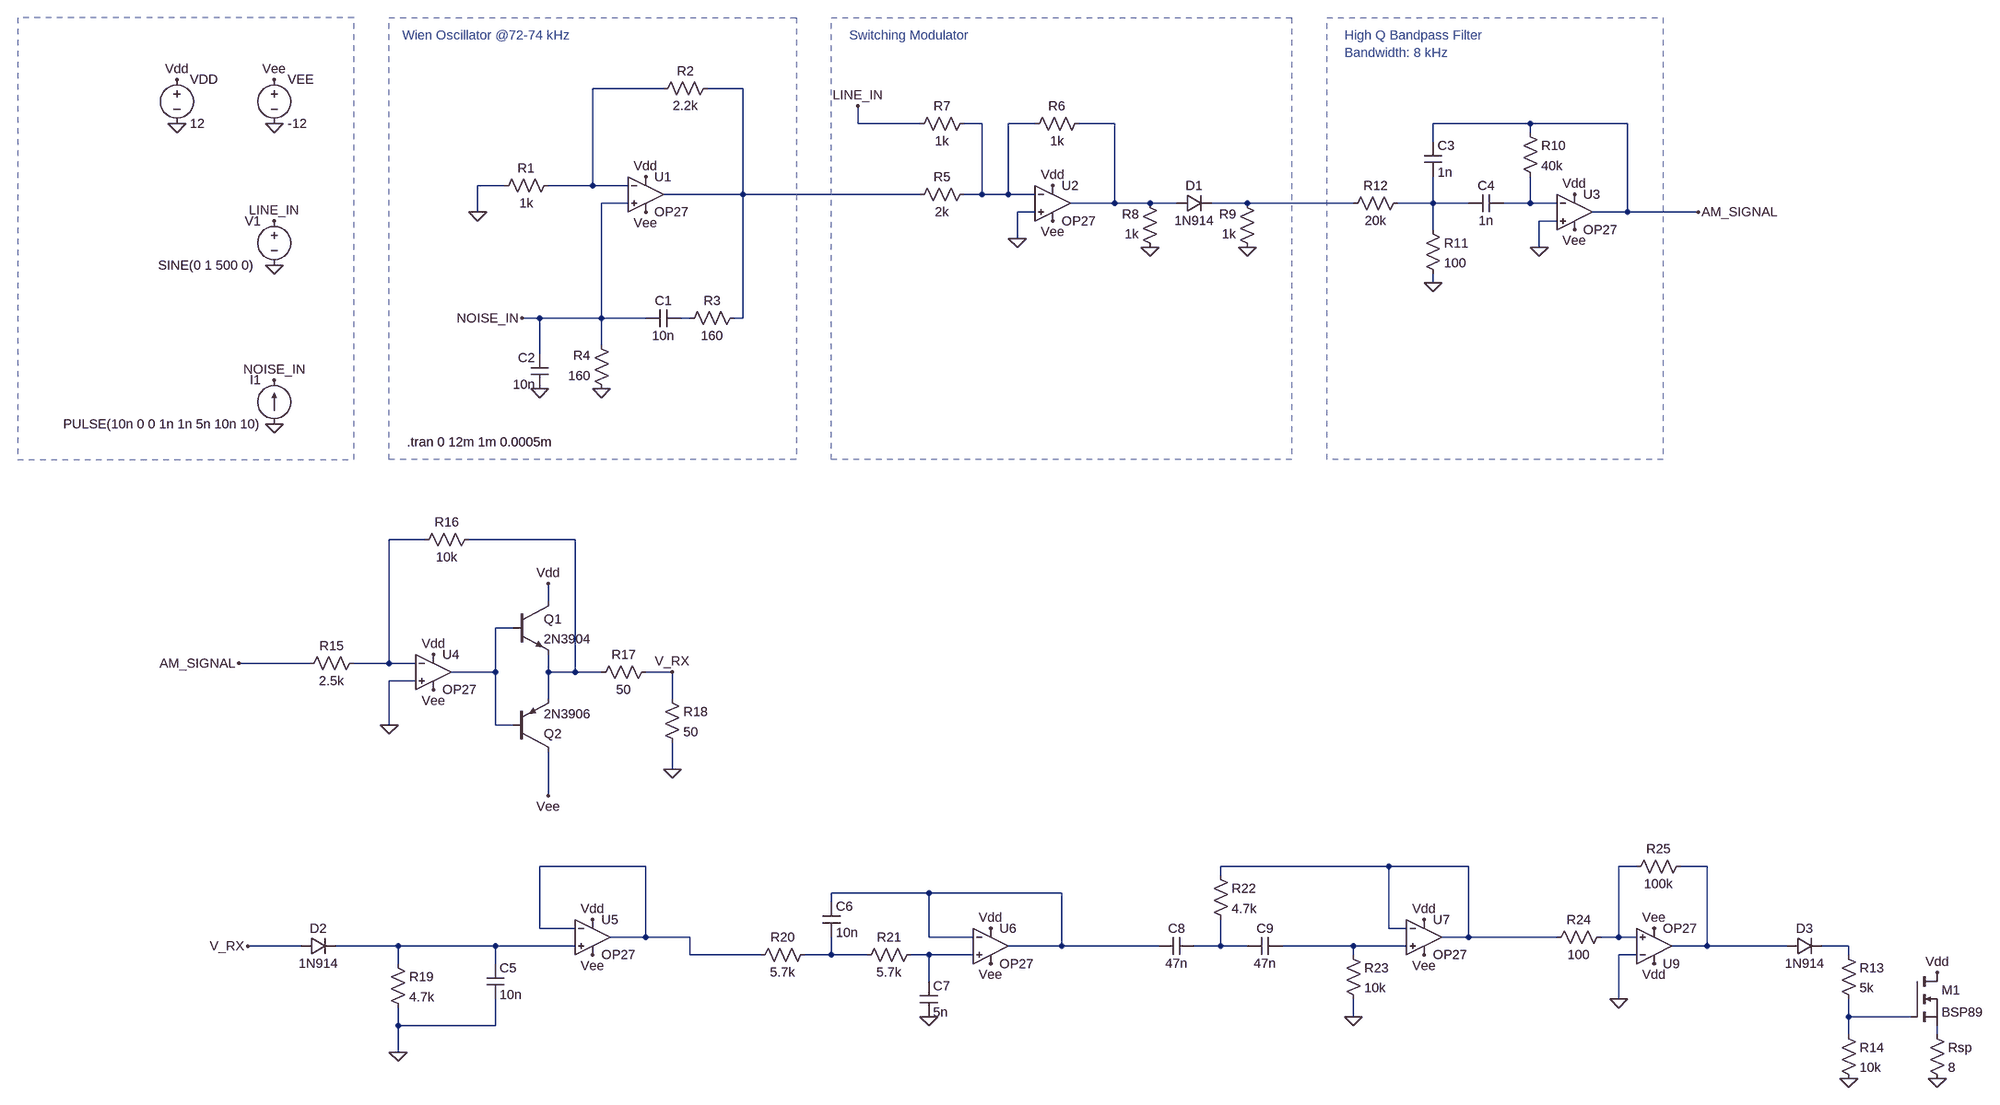
[diagram p0: schematic Draft1.asc]
Draft1.asc, the LTspice schematic file:
Version 4
SHEET 1 3092 1716
WIRE 624 -128 496 -128
WIRE 768 -128 704 -128
WIRE 976 -64 976 -96
WIRE 1088 -64 976 -64
WIRE 1200 -64 1168 -64
WIRE 1296 -64 1248 -64
WIRE 1440 -64 1376 -64
WIRE 2192 -64 2016 -64
WIRE 2368 -64 2192 -64
WIRE 2192 -48 2192 -64
WIRE 2016 -32 2016 -64
WIRE 336 48 288 48
WIRE 496 48 496 -128
WIRE 496 48 416 48
WIRE 560 48 496 48
WIRE 768 64 768 -128
WIRE 768 64 624 64
WIRE 1088 64 768 64
WIRE 1200 64 1200 -64
WIRE 1200 64 1168 64
WIRE 1248 64 1248 -64
WIRE 1248 64 1200 64
WIRE 1296 64 1248 64
WIRE 560 80 512 80
WIRE 1440 80 1440 -64
WIRE 1440 80 1360 80
WIRE 1504 80 1440 80
WIRE 1552 80 1504 80
WIRE 1680 80 1616 80
WIRE 1872 80 1680 80
WIRE 2016 80 2016 32
WIRE 2016 80 1952 80
WIRE 2080 80 2016 80
WIRE 2192 80 2192 32
WIRE 2192 80 2144 80
WIRE 2240 80 2192 80
WIRE 288 96 288 48
WIRE 1296 96 1264 96
WIRE 2368 96 2368 -64
WIRE 2368 96 2304 96
WIRE 2496 96 2368 96
WIRE 2240 112 2208 112
WIRE 2016 128 2016 80
WIRE 1264 144 1264 96
WIRE 2208 160 2208 112
WIRE 2016 224 2016 208
WIRE 400 288 368 288
WIRE 512 288 512 80
WIRE 512 288 400 288
WIRE 592 288 512 288
WIRE 672 288 656 288
WIRE 768 288 768 64
WIRE 768 288 752 288
WIRE 512 336 512 288
WIRE 400 352 400 288
WIRE 192 704 128 704
WIRE 464 704 272 704
WIRE 416 816 416 784
WIRE 352 864 320 864
WIRE -16 928 -144 928
WIRE 128 928 128 704
WIRE 128 928 64 928
WIRE 176 928 128 928
WIRE 320 944 320 864
WIRE 320 944 240 944
WIRE 416 944 416 912
WIRE 464 944 464 704
WIRE 464 944 416 944
WIRE 512 944 464 944
WIRE 640 944 592 944
WIRE 176 960 128 960
WIRE 416 992 416 944
WIRE 640 992 640 944
WIRE 128 1040 128 960
WIRE 320 1040 320 944
WIRE 352 1040 320 1040
WIRE 640 1120 640 1072
WIRE 416 1168 416 1088
WIRE 592 1296 400 1296
WIRE 1936 1296 1632 1296
WIRE 2080 1296 1936 1296
WIRE 2384 1296 2352 1296
WIRE 2512 1296 2464 1296
WIRE 1632 1312 1632 1296
WIRE 1104 1344 928 1344
WIRE 1344 1344 1104 1344
WIRE 928 1360 928 1344
WIRE 400 1408 400 1296
WIRE 464 1408 400 1408
WIRE 1936 1408 1936 1296
WIRE 1968 1408 1936 1408
WIRE 592 1424 592 1296
WIRE 592 1424 528 1424
WIRE 672 1424 592 1424
WIRE 1104 1424 1104 1344
WIRE 1184 1424 1104 1424
WIRE 2080 1424 2080 1296
WIRE 2080 1424 2032 1424
WIRE 2240 1424 2080 1424
WIRE 2352 1424 2352 1296
WIRE 2352 1424 2320 1424
WIRE 2384 1424 2352 1424
WIRE -32 1440 -128 1440
WIRE 144 1440 32 1440
WIRE 320 1440 144 1440
WIRE 464 1440 320 1440
WIRE 1344 1440 1344 1344
WIRE 1344 1440 1248 1440
WIRE 1520 1440 1344 1440
WIRE 1632 1440 1632 1392
WIRE 1632 1440 1584 1440
WIRE 1680 1440 1632 1440
WIRE 1872 1440 1744 1440
WIRE 1968 1440 1872 1440
WIRE 2512 1440 2512 1296
WIRE 2512 1440 2448 1440
WIRE 2656 1440 2512 1440
WIRE 2768 1440 2720 1440
WIRE 672 1456 672 1424
WIRE 800 1456 672 1456
WIRE 928 1456 928 1424
WIRE 928 1456 880 1456
WIRE 992 1456 928 1456
WIRE 1104 1456 1072 1456
WIRE 1184 1456 1104 1456
WIRE 1872 1456 1872 1440
WIRE 2384 1456 2352 1456
WIRE 2768 1456 2768 1440
WIRE 144 1472 144 1440
WIRE 320 1472 320 1440
WIRE 1104 1504 1104 1456
WIRE 2352 1536 2352 1456
WIRE 1872 1568 1872 1536
WIRE 2768 1568 2768 1536
WIRE 2880 1568 2768 1568
WIRE 144 1584 144 1552
WIRE 320 1584 320 1536
WIRE 320 1584 144 1584
WIRE 2768 1600 2768 1568
WIRE 2928 1600 2928 1584
WIRE 144 1632 144 1584
FLAG -256 -64 0
FLAG -80 -64 0
FLAG -256 -144 Vdd
FLAG -80 -144 Vee
FLAG 288 96 0
FLAG 512 416 0
FLAG 400 416 0
FLAG -80 480 0
FLAG 592 32 Vdd
FLAG 592 96 Vee
FLAG -80 192 0
FLAG 1504 160 0
FLAG 1680 160 0
FLAG -80 112 LINE_IN
FLAG -80 400 NOISE_IN
FLAG 368 288 NOISE_IN
FLAG 976 -96 LINE_IN
FLAG 1264 144 0
FLAG 1328 48 Vdd
FLAG 1328 112 Vee
FLAG 2208 160 0
FLAG 2272 64 Vdd
FLAG 2272 128 Vee
FLAG 2016 224 0
FLAG 2496 96 AM_SIGNAL
FLAG -144 928 AM_SIGNAL
FLAG 208 912 Vdd
FLAG 416 784 Vdd
FLAG 208 976 Vee
FLAG 416 1168 Vee
FLAG 128 1040 0
FLAG 640 1120 0
FLAG 640 944 V_RX
FLAG -128 1440 V_RX
FLAG 144 1632 0
FLAG 496 1392 Vdd
FLAG 496 1456 Vee
FLAG 1216 1408 Vdd
FLAG 1216 1472 Vee
FLAG 1104 1568 0
FLAG 2000 1392 Vdd
FLAG 2000 1456 Vee
FLAG 1872 1568 0
FLAG 2416 1472 Vdd
FLAG 2416 1408 Vee
FLAG 2352 1536 0
FLAG 2768 1680 0
FLAG 2928 1680 0
FLAG 2928 1488 Vdd
SYMBOL voltage -256 -160 R0
SYMATTR InstName VDD
SYMATTR Value 12
SYMBOL voltage -80 -160 R0
SYMATTR InstName VEE
SYMATTR Value -12
SYMBOL res 432 32 R90
WINDOW 0 0 56 VBottom 2
WINDOW 3 32 56 VTop 2
SYMATTR InstName R1
SYMATTR Value 1k
SYMBOL Opamps\\OP27 592 0 R0
SYMATTR InstName U1
SYMBOL res 720 -144 R90
WINDOW 0 0 56 VBottom 2
WINDOW 3 32 56 VTop 2
SYMATTR InstName R2
SYMATTR Value 2.2k
SYMBOL res 656 304 R270
WINDOW 0 32 56 VTop 2
WINDOW 3 0 56 VBottom 2
SYMATTR InstName R3
SYMATTR Value 160
SYMBOL res 528 432 R180
WINDOW 0 36 76 Left 2
WINDOW 3 36 40 Left 2
SYMATTR InstName R4
SYMATTR Value 160
SYMBOL cap 656 272 R90
WINDOW 0 0 32 VBottom 2
WINDOW 3 32 32 VTop 2
SYMATTR InstName C1
SYMATTR Value 10n
SYMBOL cap 416 416 R180
WINDOW 0 24 56 Left 2
WINDOW 3 24 8 Left 2
SYMATTR InstName C2
SYMATTR Value 10n
SYMBOL current -80 480 R180
WINDOW 0 24 80 Left 2
WINDOW 3 24 0 Left 2
WINDOW 123 0 0 Left 0
WINDOW 39 0 0 Left 0
SYMATTR InstName I1
SYMATTR Value PULSE(10n 0 0 1n 1n 5n 10n 10)
SYMBOL res 1184 48 R90
WINDOW 0 0 56 VBottom 2
WINDOW 3 32 56 VTop 2
SYMATTR InstName R5
SYMATTR Value 2k
SYMBOL res 1392 -80 R90
WINDOW 0 0 56 VBottom 2
WINDOW 3 32 56 VTop 2
SYMATTR InstName R6
SYMATTR Value 1k
SYMBOL res 1184 -80 R90
WINDOW 0 0 56 VBottom 2
WINDOW 3 32 56 VTop 2
SYMATTR InstName R7
SYMATTR Value 1k
SYMBOL res 1520 176 R180
WINDOW 0 36 76 Left 2
WINDOW 3 36 40 Left 2
SYMATTR InstName R8
SYMATTR Value 1k
SYMBOL res 1696 176 R180
WINDOW 0 36 76 Left 2
WINDOW 3 36 40 Left 2
SYMATTR InstName R9
SYMATTR Value 1k
SYMBOL Opamps\\OP27 1328 16 R0
SYMATTR InstName U2
SYMBOL voltage -80 96 M0
WINDOW 3 210 96 Right 2
WINDOW 123 0 0 Left 0
WINDOW 39 0 0 Left 0
SYMATTR Value SINE(0 1 500 0)
SYMATTR InstName V1
SYMBOL diode 1552 96 R270
WINDOW 0 32 32 VTop 2
WINDOW 3 0 32 VBottom 2
SYMATTR InstName D1
SYMATTR Value 1N914
SYMBOL Opamps\\OP27 2272 32 R0
SYMATTR InstName U3
SYMBOL res 2176 -64 R0
SYMATTR InstName R10
SYMATTR Value 40k
SYMBOL cap 2000 -32 R0
SYMATTR InstName C3
SYMATTR Value 1n
SYMBOL res 2000 112 R0
SYMATTR InstName R11
SYMATTR Value 100
SYMBOL res 1968 64 R90
WINDOW 0 0 56 VBottom 2
WINDOW 3 32 56 VTop 2
SYMATTR InstName R12
SYMATTR Value 20k
SYMBOL cap 2144 64 R90
WINDOW 0 0 32 VBottom 2
WINDOW 3 32 32 VTop 2
SYMATTR InstName C4
SYMATTR Value 1n
SYMBOL res 80 912 R90
WINDOW 0 0 56 VBottom 2
WINDOW 3 32 56 VTop 2
SYMATTR InstName R15
SYMATTR Value 2.5k
SYMBOL res 288 688 R90
WINDOW 0 0 56 VBottom 2
WINDOW 3 32 56 VTop 2
SYMATTR InstName R16
SYMATTR Value 10k
SYMBOL res 608 928 R90
WINDOW 0 0 56 VBottom 2
WINDOW 3 32 56 VTop 2
SYMATTR InstName R17
SYMATTR Value 50
SYMBOL res 624 976 R0
SYMATTR InstName R18
SYMATTR Value 50
SYMBOL Opamps\\OP27 208 880 R0
SYMATTR InstName U4
SYMBOL npn 352 816 R0
SYMATTR InstName Q1
SYMATTR Value 2N3904
SYMBOL pnp 352 1088 M180
SYMATTR InstName Q2
SYMATTR Value 2N3906
SYMBOL diode -32 1456 R270
WINDOW 0 32 32 VTop 2
WINDOW 3 0 32 VBottom 2
SYMATTR InstName D2
SYMATTR Value 1N914
SYMBOL res 128 1456 R0
SYMATTR InstName R19
SYMATTR Value 4.7k
SYMBOL cap 304 1472 R0
SYMATTR InstName C5
SYMATTR Value 10n
SYMBOL Opamps\\OP27 496 1360 R0
SYMATTR InstName U5
SYMBOL Opamps\\OP27 1216 1376 R0
SYMATTR InstName U6
SYMBOL res 896 1440 R90
WINDOW 0 0 56 VBottom 2
WINDOW 3 32 56 VTop 2
SYMATTR InstName R20
SYMATTR Value 5.7k
SYMBOL res 1088 1440 R90
WINDOW 0 0 56 VBottom 2
WINDOW 3 32 56 VTop 2
SYMATTR InstName R21
SYMATTR Value 5.7k
SYMBOL cap 912 1360 R0
SYMATTR InstName C6
SYMATTR Value 10n
SYMBOL cap 1088 1504 R0
SYMATTR InstName C7
SYMATTR Value 5n
SYMBOL cap 1584 1424 R90
WINDOW 0 0 32 VBottom 2
WINDOW 3 32 32 VTop 2
SYMATTR InstName C8
SYMATTR Value 47n
SYMBOL cap 1744 1424 R90
WINDOW 0 0 32 VBottom 2
WINDOW 3 32 32 VTop 2
SYMATTR InstName C9
SYMATTR Value 47n
SYMBOL res 1616 1296 R0
SYMATTR InstName R22
SYMATTR Value 4.7k
SYMBOL res 1856 1440 R0
SYMATTR InstName R23
SYMATTR Value 10k
SYMBOL Opamps\\OP27 2000 1360 R0
SYMATTR InstName U7
SYMBOL Opamps\\OP27 2416 1504 M180
SYMATTR InstName U9
SYMBOL res 2336 1408 R90
WINDOW 0 0 56 VBottom 2
WINDOW 3 32 56 VTop 2
SYMATTR InstName R24
SYMATTR Value 100
SYMBOL res 2480 1280 R90
WINDOW 0 0 56 VBottom 2
WINDOW 3 32 56 VTop 2
SYMATTR InstName R25
SYMATTR Value 100k
SYMBOL diode 2656 1456 R270
WINDOW 0 32 32 VTop 2
WINDOW 3 0 32 VBottom 2
SYMATTR InstName D3
SYMATTR Value 1N914
SYMBOL res 2752 1440 R0
SYMATTR InstName R13
SYMATTR Value 5k
SYMBOL res 2752 1584 R0
SYMATTR InstName R14
SYMATTR Value 10k
SYMBOL res 2912 1584 R0
SYMATTR InstName Rsp
SYMATTR Value 8
SYMBOL nmos 2880 1488 R0
SYMATTR InstName M1
SYMATTR Value BSP89
TEXT 160 512 Left 2 !.tran 0 12m 1m 0.0005m
TEXT 152 -224 Left 2 ;Wien Oscillator @72-74 kHz
TEXT 960 -224 Left 2 ;Switching Modulator
TEXT 1856 -224 Left 2 ;High Q Bandpass Filter\nBandwidth: 8 kHz
RECTANGLE Normal 864 544 128 -256 2
RECTANGLE Normal 1760 544 928 -256 2
RECTANGLE Normal -544 544 64 -256 2
RECTANGLE Normal 2432 544 1824 -256 2

The netlist it stands for:
* Draft1.asc
VDD Vdd 0 12
VEE Vee 0 -12
R1 N001 0 1k
XU1 NOISE_IN N001 Vdd Vee N002 OP27  ; pins In+ In- V+ V- OUT
R2 N002 N001 2.2k
R3 N008 N002 160
R4 0 NOISE_IN 160
C1 N008 NOISE_IN 10n
C2 0 NOISE_IN 10n
I1 0 NOISE_IN PULSE(10n 0 0 1n 1n 5n 10n 10)
R5 N003 N002 2k
R6 N004 N003 1k
R7 N003 LINE_IN 1k
R8 0 N004 1k
R9 0 N005 1k
XU2 0 N003 Vdd Vee N004 OP27  ; pins In+ In- V+ V- OUT
V1 LINE_IN 0 SINE(0 1 500 0)
D1 N004 N005 1N914
XU3 0 N007 Vdd Vee AM_SIGNAL OP27  ; pins In+ In- V+ V- OUT
R10 AM_SIGNAL N007 40k
C3 AM_SIGNAL N006 1n
R11 N006 0 100
R12 N006 N005 20k
C4 N007 N006 1n
R15 N009 AM_SIGNAL 2.5k
R16 N010 N009 10k
R17 V_RX N010 50
R18 V_RX 0 50
XU4 0 N009 Vdd Vee N011 OP27  ; pins In+ In- V+ V- OUT
Q1 Vdd N011 N010 0 2N3904
Q2 Vee N011 N010 0 2N3906
D2 V_RX N017 1N914
R19 N017 0 4.7k
C5 N017 0 10n
XU5 N017 N012 Vdd Vee N012 OP27  ; pins In+ In- V+ V- OUT
XU6 N022 N016 Vdd Vee N016 OP27  ; pins In+ In- V+ V- OUT
R20 N021 N012 5.7k
R21 N022 N021 5.7k
C6 N016 N021 10n
C7 N022 0 5n
C8 N018 N016 47n
C9 N019 N018 47n
R22 N013 N018 4.7k
R23 N019 0 10k
XU7 N019 N013 Vdd Vee N013 OP27  ; pins In+ In- V+ V- OUT
XU9 N014 0 Vdd Vee N015 OP27  ; pins In+ In- V+ V- OUT
R24 N014 N013 100
R25 N015 N014 100k
D3 N015 N020 1N914
R13 N020 N023 5k
R14 N023 0 10k
Rsp N024 0 8
M1 Vdd N023 N024 N024 BSP89
.model D D
.lib standard.dio
.model NPN NPN
.model PNP PNP
.lib standard.bjt
.model NMOS NMOS
.model PMOS PMOS
.lib standard.mos
.tran 0 12m 1m 0.0005m
* Wien Oscillator @72-74 kHz
* Switching Modulator
* High Q Bandpass Filter
* Bandwidth: 8 kHz
.lib ADI.lib
.backanno
.end